# Altium project EEE3061WDesignProject_ControllerBoard.PrjPCB
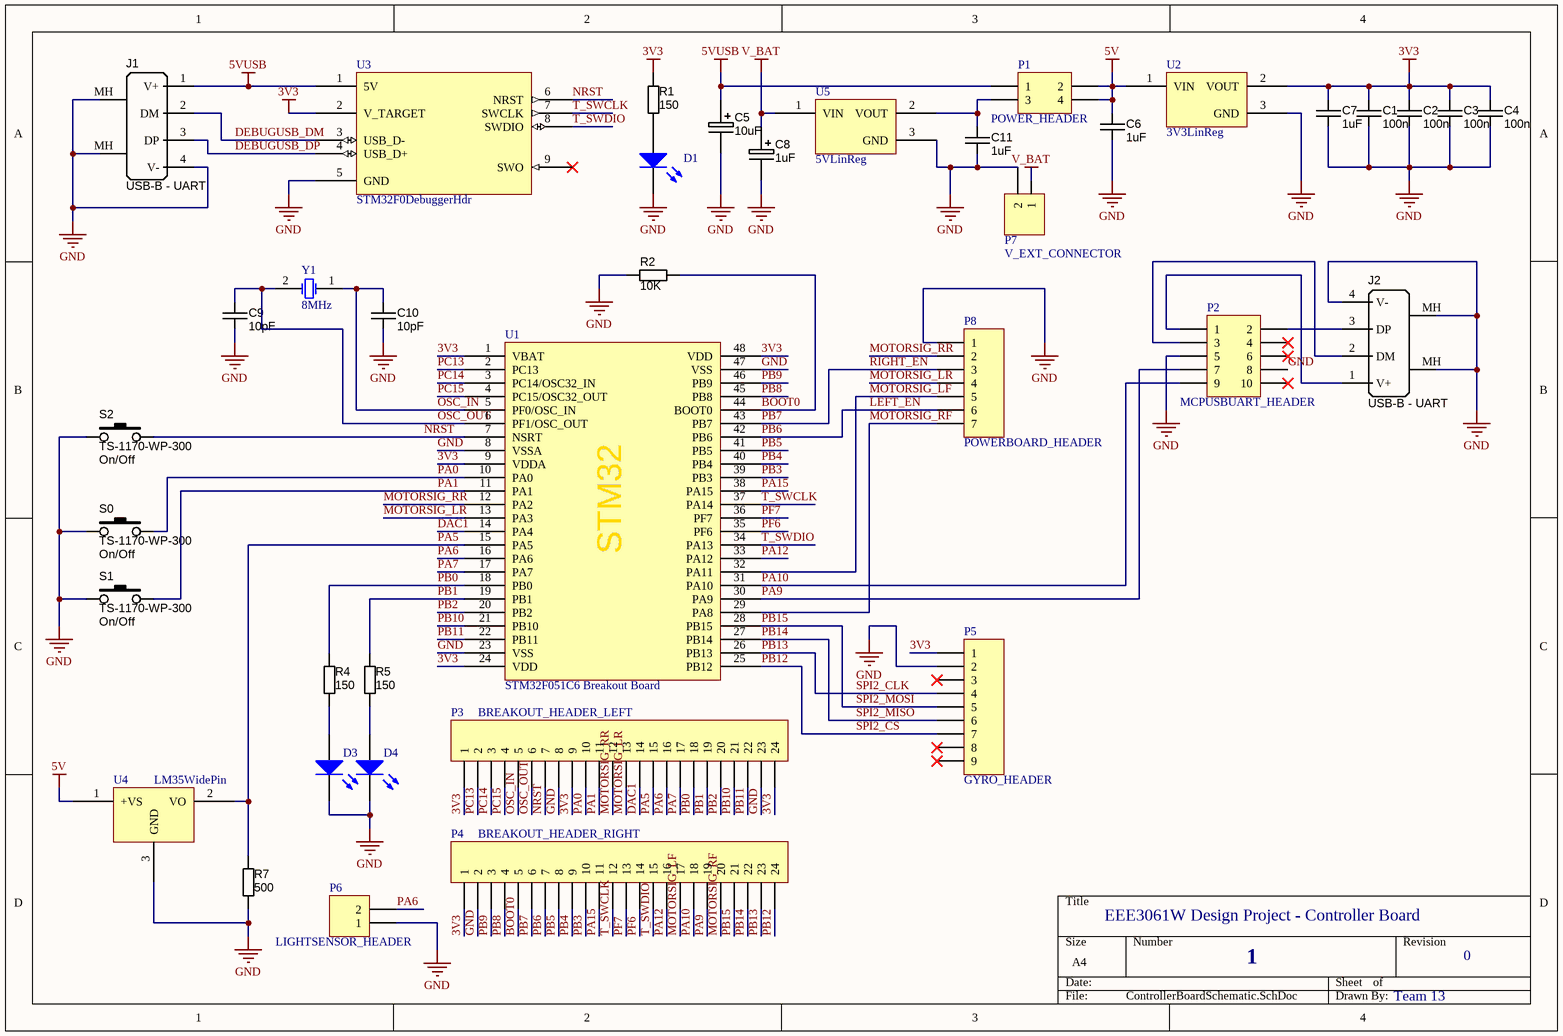
[diagram p0: ControllerBoardSchematic.SchDoc]
1 sheet, 38 parts. Net scope: global (net labels, ports and power ports of the same name join across sheets).
Board file: ControllerBoardPCB.PcbDoc

## Sheet ControllerBoardSchematic.SchDoc: EEE3061W Design Project - Controller Board
size A4; DrawnBy: Team 13; DocumentNumber: 1; Revision: 0; DocumentName: ControllerBoardSchematic

### Parts
C1  100n  [CAPC500P450250X550_2.5mm]
C2  100n  [CAPC500P450250X550_2.5mm]
C3  100n  [CAPC500P450250X550_2.5mm]
C4  100n  [CAPC500P450250X550_2.5mm]
C5  10uF  [CAPE10.0MM_Rad_10x14mm]
C6  1uF  [CAPC500P450250X550_2.5mm]
C7  1uF  [CAPC500P450250X550_2.5mm]
C8  1uF  [CAPE10.0MM_Rad_10x14mm]
C9  10pF  [CAPC500P450250X550_2.5mm]
C10  10pF  [CAPC500P450250X550_2.5mm]
C11  1uF  [CAPC500P450250X550_2.5mm]
D1  LED1  [LED-1]  (value not drawn)
D3  LED1  [LED-1]  (value not drawn)
D4  LED1  [LED-1]  (value not drawn)
J1  USB-B - UART  [USB_TypeB_Tyco]
J2  USB-B - UART  [USB_TypeB_Tyco]
P1  POWER_HEADER  [HDR2X2]
P2  MCPUSBUART_HEADER  [HDR2X5]
P3  BREAKOUT_HEADER_LEFT  [HDR1X24]
P4  BREAKOUT_HEADER_RIGHT  [HDR1X24]
P5  GYRO_HEADER  [HDR1X9]
P6  LIGHTSENSOR_HEADER  [HDR1X2]
P7  V_EXT_CONNECTOR  [HDR1X2]
P8  POWERBOARD_HEADER  [HDR1X7]
R1  value 150  [RESTH_AXIAL-0.4]  (hidden comment: Carbon Film)
R2  value 10K  [RESTH_AXIAL-0.4]  (hidden comment: Carbon Film)
R4  value 150  [RESTH_AXIAL-0.4]  (hidden comment: Carbon Film)
R5  value 150  [RESTH_AXIAL-0.4]  (hidden comment: Carbon Film)
R7  value 500  [RESTH_AXIAL-0.4]  (hidden comment: Carbon Film)
S0  Manufacturer Part Number 1: TS-1170-WP-300  Function: On/Off  [TACT-SWITCH-TS1170]  (hidden comment: SW_THT_PB_7.0mm)
S1  Manufacturer Part Number 1: TS-1170-WP-300  Function: On/Off  [TACT-SWITCH-TS1170]  (hidden comment: SW_THT_PB_7.0mm)
S2  Manufacturer Part Number 1: TS-1170-WP-300  Function: On/Off  [TACT-SWITCH-TS1170]  (hidden comment: SW_THT_PB_7.0mm)
U1  STM32F051C6 Breakout Board  [STM32F051C6BreakoutBoard]
U2  3V3LinReg  [TO-92Wide]
U3  STM32F0DebuggerHdr  [STM32F051C6_DbgrHdr]
U4  LM35WidePin  [TO-92Wide]
U5  5VLinReg  [TO-92Wide]
Y1  8MHz  [8MHZOSC]

### Nets
3V3: C1.1 C2.1 C3.1 C4.1 C7.1 P3.1 P3.9 P3.24 P4.1 P5.1 R1.2 U1.1(VBAT) U1.9(VDDA) U1.24(VDD) U1.48(VDD) U2.2(VOUT) U3.2(V_TARGET)
5V: C6.1 P1.2 P1.4 U2.1(VIN) U4.1(+VS)
5VUSB: C5.1 J1.1(V+) P1.1 U3.1(5V)
GND: C1.2 C2.2 C3.2 C4.2 C5.2 C6.2 C7.2 C8.2 C9.2 C10.2 C11.2 D1.2(K) D3.2(K) D4.2(K) J1.4(V-) J1.MH(Shell) J2.4(V-) J2.MH(Shell) P2.5 P2.8 P3.8 P3.23 P4.2 P5.2 P6.1 P7.2 P8.1 R2.1 R7.2 S0.1 S1.1 S2.1 U1.8(VSSA) U1.23(VSS) U1.47(VSS) U2.3(GND) U3.5(GND) U4.3(GND) U5.3(GND)
V_BAT: C8.1 P7.1 U5.1(VIN)
BOOT0: P4.5 R2.2 U1.44(BOOT0)
DAC1: P3.14 U1.14(PA4)
DEBUGUSB_DM: J1.2(DM) U3.3(USB_D-)
DEBUGUSB_DP: J1.3(DP) U3.4(USB_D+)
LEFT_EN: P4.7 P8.6 U1.42(PB6)  [also labelled PB6]
MOTORSIG_LF: P4.17 P8.5 U1.32(PA11)
MOTORSIG_LR: P3.13 P8.4 U1.13(PA3)
MOTORSIG_RF: P4.20 P8.7 U1.29(PA8)
MOTORSIG_RR: P3.12 P8.2 U1.12(PA2)
NRST: P3.7 S2.2 U1.7(NSRT) U3.6(NRST)
OSC_IN: C10.1 P3.5 U1.5(PF0/OSC_IN) Y1.1(OSC1)
OSC_OUT: C9.1 P3.6 U1.6(PF1/OSC_OUT) Y1.2(OSC2)
PA0: P3.10 S0.2 U1.10(PA0)
PA1: P3.11 S1.2 U1.11(PA1)
PA5: P3.15 R7.1 U1.15(PA5) U4.2(VO)
PA6: P3.16 P6.2 U1.16(PA6)
PA7: P3.17 U1.17(PA7)
PA9: P2.7 P4.19 U1.30(PA9)
PA10: P2.9 P4.18 U1.31(PA10)
PA12: P4.16 U1.33(PA12)
PA15: P4.11 U1.38(PA15)
PB0: P3.18 R4.1 U1.18(PB0)
PB1: P3.19 R5.1 U1.19(PB1)
PB2: P3.20 U1.20(PB2)
PB3: P4.10 U1.39(PB3)
PB4: P4.9 U1.40(PB4)
PB5: P4.8 U1.41(PB5)
PB7: P4.6 P8.3 U1.43(PB7)  [also labelled RIGHT_EN]
PB8: P4.4 U1.45(PB8)
PB9: P4.3 U1.46(PB9)
PB10: P3.21 U1.21(PB10)
PB11: P3.22 U1.22(PB11)
PB12: P4.24 P5.7 U1.25(PB12)  [also labelled SPI2_CS]
PB13: P4.23 P5.4 U1.26(PB13)  [also labelled SPI2_CLK]
PB14: P4.22 P5.6 U1.27(PB14)  [also labelled SPI2_MISO]
PB15: P4.21 P5.5 U1.28(PB15)  [also labelled SPI2_MOSI]
PC13: P3.2 U1.2(PC13)
PC14: P3.3 U1.3(PC14/OSC32_IN)
PC15: P3.4 U1.4(PC15/OSC32_OUT)
PF6: P4.14 U1.35(PF6)
PF7: P4.13 U1.36(PF7)
T_SWCLK: P4.12 U1.37(PA14) U3.7(SWCLK)
T_SWDIO: P4.15 U1.34(PA13) U3.8(SWDIO)
NetC11_1: C11.1 P1.3 U5.2(VOUT)
NetD1_1: D1.1(A) R1.1
NetD3_1: D3.1(A) R4.2
NetD4_1: D4.1(A) R5.2
NetJ2_1: J2.1(V+) P2.1
NetJ2_2: J2.2(DM) P2.3
NetJ2_3: J2.3(DP) P2.2

Not connected (* = marked no-connect by the designer): P2 4* 6* 10*; P5 3* 8* 9*; U3 9(SWO)*

### Notes on the sheet
- (in symbol STM32F051C6Brk) STM32

### Library data of the parts
C1-C4 C6 C7 C9-C11 = CAPR_220n_Radial_5mm: Capacitor Ceramic 220nF 10% 50V X7R radial 5mm lead spacing; Manufacturer 1: TDK Corporation; Manufacturer Part Number 1: FK24X7R1H224K; Ratings: 50V; X7R; SCDType: spec; Tolerance: ±10%; Material: ceramic; Supplier 1: Digi-Key; Supplier Part Number 1: 445-2855-ND; Package / Case: 0.217" L x 0.177" W (5.50mm x 4.50mm) radial 5mm LS; Operating Temperature: -55°C ~ 125°C; ComponentLink1URL: http://www.tdk.co.jp/tefe02/e4941_fk.pdf; ComponentLink1Description: e4941_fk datasheet
  C1-C4: Value: 100n
  C6 C7 C11: Value: 1uF
  C9 C10: Value: 10pF
C5 C8 = CAPE_470u_16V_THT: Capacitor THT Alum Elec 470uF 20% 16V; Manufacturer 1: NICHICON; Manufacturer Part Number 1: UHM1C471MPD6; Ratings: 16V; 105°C; Material: Al Electrolytic; SCDType: undef; Package / Case: Radial; Tolerance: ±20%; Supplier 1: Newark; Supplier Part Number 1: 54K8151; Manufacturer 2: JD; Manufacturer Part Number 2: GT470UF16V_10x12mm
  C5: Value: 10uF
  C8: Value: 1uF
D1 D3 D4 = LED1: Typical RED GaAs LED; Published: 8-Jun-2000; LatestRevisionDate: 08-Jul-2005; LatestRevisionNote: Mech Layer 1 removed.; PackageReference: LED-1; Publisher: Altium Limited; PackageDescription: LED; 2 Leads
J1 J2 = USB_TypeB: Connector THT Type B USB connector; Manufacturer Part Number 1: 292304-1; Manufacturer 1: TE Connectivity; Specifications: USB 2.0; SCDType: undef; Package / Case: R/A Type B; Supplier 1: Digi-Key; Connector Type: USB - B; Supplier Part Number 1: A31725-ND
P1 = Header 2X2: Header, 2-Pin, Dual row; LatestRevisionDate: 17-Jul-2002; LatestRevisionNote: Re-released for DXP Platform.; Publisher: Altium Limited
P2 = Header 5X2: Header, 5-Pin, Dual row; LatestRevisionDate: 17-Jul-2002; LatestRevisionNote: Re-released for DXP Platform.; Publisher: Altium Limited
P3 P4 = Header 24: Header, 24-Pin; LatestRevisionDate: 17-Jul-2002; LatestRevisionNote: Re-released for DXP Platform.; Publisher: Altium Limited
P5 = Header 9: Header, 9-Pin; LatestRevisionDate: 17-Jul-2002; LatestRevisionNote: Re-released for DXP Platform.; Publisher: Altium Limited
P6 P7 = Header 2: Header, 2-Pin; LatestRevisionDate: 17-Jul-2002; LatestRevisionNote: Re-released for DXP Platform.; Publisher: Altium Limited
P8 = Header 7: Header, 7-Pin; LatestRevisionDate: 17-Jul-2002; LatestRevisionNote: Re-released for DXP Platform.; Publisher: Altium Limited
R1 R2 R4 R5 R7 = RES_1K_Axial_0.25W_5%: Resistor THD Axial 1k Ohm 0.25W 5% Carbon Film; Manufacturer 1: Yageo; Manufacturer Part Number 1: CFR-25JB-1K0; Ratings: 1/4W; SCDType: spec; Tolerance: ±5%; Package / Case: Axial; Supplier 1: Digi-Key; Supplier Part Number 1: 1.0KQBK-ND
S0-S2 = SW_THT_PB_7.0mm: Switch, tact, 7.0mm stem; Manufacturer 1: Bond-Tact; SCDType: source*; Package / Case: 6.5x6.5mm; 7.0mm stem; Material: Brass/Nylon/Ag plating
U1 = STM32F051C6Brk
U2 U5 = VREG5V: MCP
U4 = LM35Big
Y1 = XTAL: Crystal Oscillator; Published: 8-Jun-2000; LatestRevisionDate: 17-Jul-2002; LatestRevisionNote: Re-released for DXP Platform.; PackageReference: R38; Publisher: Altium Limited; PackageDescription: Crystal, Thru-Hole; 2 Leads; Body 3.1 x 8.2 mm (Dia.xH)